# Altium schematic sheet MCU.SchDoc
size A3; DocumentNumber: 6; SheetNumber: 6; SheetTotal: 11
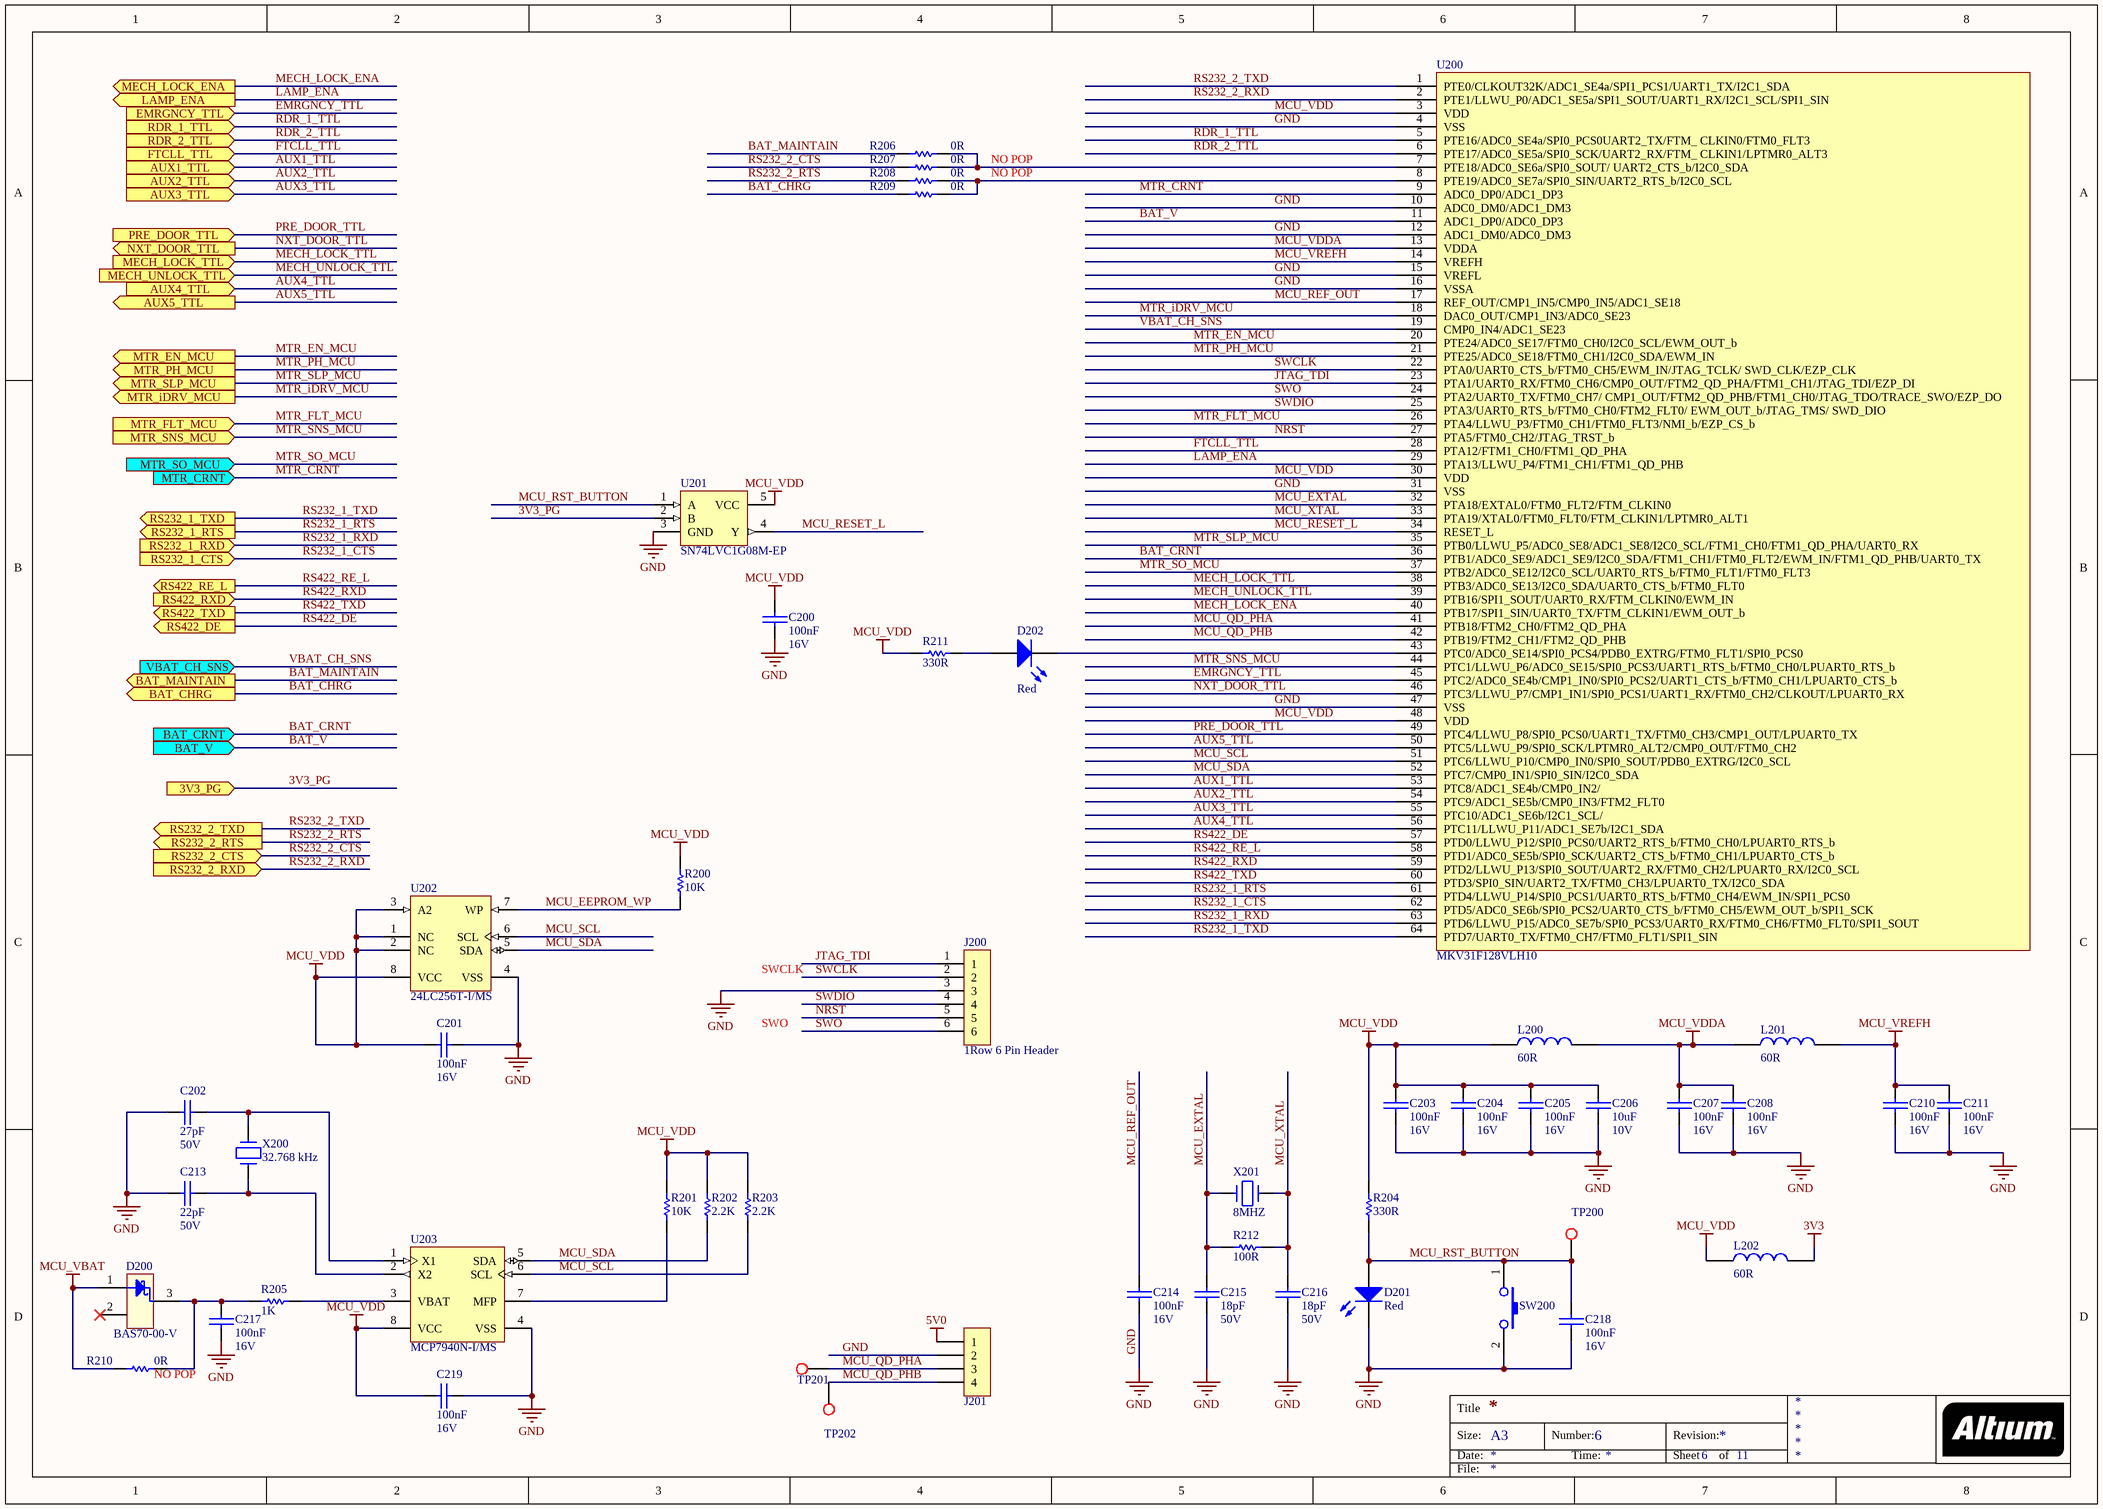
[diagram p0: MCU.SchDoc]

## Parts
C200  Operating Voltage: 16V  [CAPC1005X06N]  (hidden comment: 100nF)
C201  Operating Voltage: 16V  [CAPC1005X06N]  (hidden comment: 100nF)
C202  Operating Voltage: 50V  [CAPC1005X06N]  (hidden comment: 27pF)
C203  Operating Voltage: 16V  [CAPC1005X06N]  (hidden comment: 100nF)
C204  Operating Voltage: 16V  [CAPC1005X06N]  (hidden comment: 100nF)
C205  Operating Voltage: 16V  [CAPC1005X06N]  (hidden comment: 100nF)
C206  Operating Voltage: 10V  [CAPC2012X09N]  (hidden comment: 10uF)
C207  Operating Voltage: 16V  [CAPC1005X06N]  (hidden comment: 100nF)
C208  Operating Voltage: 16V  [CAPC1005X06N]  (hidden comment: 100nF)
C210  Operating Voltage: 16V  [CAPC1005X06N]  (hidden comment: 100nF)
C211  Operating Voltage: 16V  [CAPC1005X06N]  (hidden comment: 100nF)
C213  Operating Voltage: 50V  [CAPC1005X06N]  (hidden comment: 22pF)
C214  Operating Voltage: 16V  [CAPC1005X06N]  (hidden comment: 100nF)
C215  Operating Voltage: 50V  [CAPC1005X06N]  (hidden comment: 18pF)
C216  Operating Voltage: 50V  [CAPC1005X06N]  (hidden comment: 18pF)
C217  Operating Voltage: 16V  [CAPC1005X06N]  (hidden comment: 100nF)
C218  Operating Voltage: 16V  [CAPC1005X06N]  (hidden comment: 100nF)
C219  Operating Voltage: 16V  [CAPC1005X06N]  (hidden comment: 100nF)
D200  BAS70-00-V  [SOT90P247X115-3N]
D201  Red  [LEDSC16X08X08-2N]
D202  Red  [LEDSC16X08X08-2N]
J200  1Row 6 Pin Header  [AJ23-1006-T8P0-VFC0]
J201  (no value)  [AJ61-1004-TAPR-RNS0]
L200  60R  [INDC2012X10N]
L201  60R  [INDC2012X10N]
L202  60R  [INDC2012X10N]
R200  10K  [RESC1005X04N]
R201  10K  [RESC1005X04N]
R202  2.2K  [RESC1005X04N]
R203  2.2K  [RESC1005X04N]
R204  330R  [RESC1005X04N]
R205  1K  [RESC1005X04N]
R206  0R  [RESC1005X04N]
R207  Assembly: NO POP  [RESC1005X04N]  (hidden comment: 0R)
R208  Assembly: NO POP  [RESC1005X04N]  (hidden comment: 0R)
R209  0R  [RESC1005X04N]
R210  Assembly: NO POP  [RESC2012X07N]  (hidden comment: 0R)
R211  330R  [RESC1005X04N]
R212  100R  [RESC1005X04N]
SW200  Push Button  [AE22-010S-0000-0000]  (value not drawn)
TP200  AEMT-C00S-1000-0000  [TP100]  (value not drawn)
TP201  AEMT-C00S-1000-0000  [TP100]  (value not drawn)
TP202  AEMT-C00S-1000-0000  [TP100]  (value not drawn)
U200  MKV31F128VLH10  [TSQFP50P1200X1200X160-64N]
U201  SN74LVC1G08M-EP  [SOT65P210X110-5N]
U202  24LC256T-I/MS  [MSOP-MS8_N]
U203  MCP7940N-I/MS  [MSOP-MS8_N]
X200  32.768 kHz  [XTAL32X15X09]
X201  8MHZ  [XTAL50X32X13]

## Ports
3V3_PG (in), AUX1_TTL (in), AUX2_TTL (in), AUX3_TTL (in), AUX4_TTL (in), AUX5_TTL (out), BAT_CHRG (out), BAT_CRNT (in), BAT_MAINTAIN (out), BAT_V (in), EMRGNCY_TTL (in), FTCLL_TTL (in), LAMP_ENA (out), MECH_LOCK_ENA (out), MECH_LOCK_TTL (in), MECH_UNLOCK_TTL (in), MTR_CRNT (in), MTR_EN_MCU (out), MTR_FLT_MCU (in), MTR_iDRV_MCU (out), MTR_PH_MCU (out), MTR_SLP_MCU (out), MTR_SNS_MCU (in), MTR_SO_MCU (in), NXT_DOOR_TTL (out), PRE_DOOR_TTL (in), RDR_1_TTL (in), RDR_2_TTL (in), RS232_1_CTS (in), RS232_1_RTS (out), RS232_1_RXD (in), RS232_1_TXD (out), RS232_2_CTS (in), RS232_2_RTS (out), RS232_2_RXD (in), RS232_2_TXD (out), RS422_DE (out), RS422_RE_L (out), RS422_RXD (in), RS422_TXD (out), VBAT_CH_SNS (in)

## Nets
3V3: L202.2
5V0: J201.1
GND: C200.2 C201.1 C202.1 C203.1 C204.1 C205.1 C206.1 C207.1 C208.1 C210.1 C211.1 C213.1 C214.1 C215.2 C216.2 C217.2 C218.1 C219.1 D201.1(K) J200.3 J201.2 SW200.2 U200.4(VSS) U200.10(ADC0_DM0/ADC1_DM3) U200.12(ADC1_DM0/ADC0_DM3) U200.15(VREFL) U200.16(VSSA) U200.31(VSS) U200.47(VSS) U201.3(GND) U202.4(VSS) U203.4(VSS)
MCU_VBAT: D200.1 R210.1
MCU_VDD: C200.1 C201.2 C203.2 C204.2 C205.2 C206.2 C219.2 L200.1 L202.1 R200.2 R201.2 R202.2 R203.2 R204.2 R211.2 U200.3(VDD) U200.30(VDD) U200.48(VDD) U201.5(VCC) U202.1(NC) U202.2(NC) U202.3(A2) U202.8(VCC) U203.8(VCC)
MCU_VDDA: C207.2 C208.2 L200.2 L201.1 U200.13(VDDA)
MCU_VREFH: C210.2 C211.2 L201.2 U200.14(VREFH)
3V3_PG: U201.2(B) ; port 3V3_PG
AUX1_TTL: U200.53(PTC8/ADC1_SE4b/CMP0_IN2/) ; port AUX1_TTL
AUX2_TTL: U200.54(PTC9/ADC1_SE5b/CMP0_IN3/FTM2_FLT0) ; port AUX2_TTL
AUX3_TTL: U200.55(PTC10/ADC1_SE6b/I2C1_SCL/) ; port AUX3_TTL
AUX4_TTL: U200.56(PTC11/LLWU_P11/ADC1_SE7b/I2C1_SDA) ; port AUX4_TTL
AUX5_TTL: U200.50(PTC5/LLWU_P9/SPI0_SCK/LPTMR0_ALT2/CMP0_OUT/FTM0_CH2) ; port AUX5_TTL
BAT_CHRG: R209.1 ; port BAT_CHRG
BAT_CRNT: U200.36(PTB1/ADC0_SE9/ADC1_SE9/I2C0_SDA/FTM1_CH1/FTM0_FLT2/EWM_IN/FTM1_QD_PHB/UART0_TX) ; port BAT_CRNT
BAT_MAINTAIN: R206.1 ; port BAT_MAINTAIN
BAT_V: U200.11(ADC1_DP0/ADC0_DP3) ; port BAT_V
EMRGNCY_TTL: U200.45(PTC2/ADC0_SE4b/CMP1_IN0/SPI0_PCS2/UART1_CTS_b/FTM0_CH1/LPUART0_CTS_b) ; port EMRGNCY_TTL
FTCLL_TTL: U200.28(PTA12/FTM1_CH0/FTM1_QD_PHA) ; port FTCLL_TTL
JTAG_TDI: J200.1 U200.23(PTA1/UART0_RX/FTM0_CH6/CMP0_OUT/FTM2_QD_PHA/FTM1_CH1/JTAG_TDI/EZP_DI)
LAMP_ENA: U200.29(PTA13/LLWU_P4/FTM1_CH1/FTM1_QD_PHB) ; port LAMP_ENA
MCU_EEPROM_WP: R200.1 U202.7(WP)
MCU_EXTAL: C215.1 R212.1 U200.32(PTA18/EXTAL0/FTM0_FLT2/FTM_CLKIN0) X201.1
MCU_QD_PHA: J201.3 TP201.1 U200.41(PTB18/FTM2_CH0/FTM2_QD_PHA)
MCU_QD_PHB: J201.4 TP202.1 U200.42(PTB19/FTM2_CH1/FTM2_QD_PHB)
MCU_REF_OUT: C214.2 U200.17(REF_OUT/CMP1_IN5/CMP0_IN5/ADC1_SE18)
MCU_RESET_L: U200.34(RESET_L) U201.4(Y)
MCU_RST_BUTTON: C218.2 D201.2(A) R204.1 SW200.1 TP200.1 U201.1(A)
MCU_SCL: R203.1 U200.51(PTC6/LLWU_P10/CMP0_IN0/SPI0_SOUT/PDB0_EXTRG/I2C0_SCL) U202.6(SCL) U203.6(SCL)
MCU_SDA: R202.1 U200.52(PTC7/CMP0_IN1/SPI0_SIN/I2C0_SDA) U202.5(SDA) U203.5(SDA)
MCU_XTAL: C216.1 R212.2 U200.33(PTA19/XTAL0/FTM0_FLT0/FTM_CLKIN1/LPTMR0_ALT1) X201.2
MECH_LOCK_ENA: U200.40(PTB17/SPI1_SIN/UART0_TX/FTM_CLKIN1/EWM_OUT_b) ; port MECH_LOCK_ENA
MECH_LOCK_TTL: U200.38(PTB3/ADC0_SE13/I2C0_SDA/UART0_CTS_b/FTM0_FLT0) ; port MECH_LOCK_TTL
MECH_UNLOCK_TTL: U200.39(PTB16/SPI1_SOUT/UART0_RX/FTM_CLKIN0/EWM_IN) ; port MECH_UNLOCK_TTL
MTR_CRNT: U200.9(ADC0_DP0/ADC1_DP3) ; port MTR_CRNT
MTR_EN_MCU: U200.20(PTE24/ADC0_SE17/FTM0_CH0/I2C0_SCL/EWM_OUT_b) ; port MTR_EN_MCU
MTR_FLT_MCU: U200.26(PTA4/LLWU_P3/FTM0_CH1/FTM0_FLT3/NMI_b/EZP_CS_b) ; port MTR_FLT_MCU
MTR_iDRV_MCU: U200.18(DAC0_OUT/CMP1_IN3/ADC0_SE23) ; port MTR_iDRV_MCU
MTR_PH_MCU: U200.21(PTE25/ADC0_SE18/FTM0_CH1/I2C0_SDA/EWM_IN) ; port MTR_PH_MCU
MTR_SLP_MCU: U200.35(PTB0/LLWU_P5/ADC0_SE8/ADC1_SE8/I2C0_SCL/FTM1_CH0/FTM1_QD_PHA/UART0_RX) ; port MTR_SLP_MCU
MTR_SNS_MCU: U200.44(PTC1/LLWU_P6/ADC0_SE15/SPI0_PCS3/UART1_RTS_b/FTM0_CH0/LPUART0_RTS_b) ; port MTR_SNS_MCU
MTR_SO_MCU: U200.37(PTB2/ADC0_SE12/I2C0_SCL/UART0_RTS_b/FTM0_FLT1/FTM0_FLT3) ; port MTR_SO_MCU
NRST: J200.5 U200.27(PTA5/FTM0_CH2/JTAG_TRST_b)
NXT_DOOR_TTL: U200.46(PTC3/LLWU_P7/CMP1_IN1/SPI0_PCS1/UART1_RX/FTM0_CH2/CLKOUT/LPUART0_RX) ; port NXT_DOOR_TTL
PRE_DOOR_TTL: U200.49(PTC4/LLWU_P8/SPI0_PCS0/UART1_TX/FTM0_CH3/CMP1_OUT/LPUART0_TX) ; port PRE_DOOR_TTL
RDR_1_TTL: U200.5(PTE16/ADC0_SE4a/SPI0_PCS0UART2_TX/FTM__CLKIN0/FTM0_FLT3) ; port RDR_1_TTL
RDR_2_TTL: U200.6(PTE17/ADC0_SE5a/SPI0_SCK/UART2_RX/FTM__CLKIN1/LPTMR0_ALT3) ; port RDR_2_TTL
RS232_1_CTS: U200.62(PTD5/ADC0_SE6b/SPI0_PCS2/UART0_CTS_b/FTM0_CH5/EWM_OUT_b/SPI1_SCK) ; port RS232_1_CTS
RS232_1_RTS: U200.61(PTD4/LLWU_P14/SPI0_PCS1/UART0_RTS_b/FTM0_CH4/EWM_IN/SPI1_PCS0) ; port RS232_1_RTS
RS232_1_RXD: U200.63(PTD6/LLWU_P15/ADC0_SE7b/SPI0_PCS3/UART0_RX/FTM0_CH6/FTM0_FLT0/SPI1_SOUT) ; port RS232_1_RXD
RS232_1_TXD: U200.64(PTD7/UART0_TX/FTM0_CH7/FTM0_FLT1/SPI1_SIN) ; port RS232_1_TXD
RS232_2_CTS: R207.1 ; port RS232_2_CTS
RS232_2_RTS: R208.1 ; port RS232_2_RTS
RS232_2_RXD: U200.2(PTE1/LLWU_P0/ADC1_SE5a/SPI1_SOUT/UART1_RX/I2C1_SCL/SPI1_SIN) ; port RS232_2_RXD
RS232_2_TXD: U200.1(PTE0/CLKOUT32K/ADC1_SE4a/SPI1_PCS1/UART1_TX/I2C1_SDA) ; port RS232_2_TXD
RS422_DE: U200.57(PTD0/LLWU_P12/SPI0_PCS0/UART2_RTS_b/FTM0_CH0/LPUART0_RTS_b) ; port RS422_DE
RS422_RE_L: U200.58(PTD1/ADC0_SE5b/SPI0_SCK/UART2_CTS_b/FTM0_CH1/LPUART0_CTS_b) ; port RS422_RE_L
RS422_RXD: U200.59(PTD2/LLWU_P13/SPI0_SOUT/UART2_RX/FTM0_CH2/LPUART0_RX/I2C0_SCL) ; port RS422_RXD
RS422_TXD: U200.60(PTD3/SPI0_SIN/UART2_TX/FTM0_CH3/LPUART0_TX/I2C0_SDA) ; port RS422_TXD
SWCLK: J200.2 U200.22(PTA0/UART0_CTS_b/FTM0_CH5/EWM_IN/JTAG_TCLK/_SWD_CLK/EZP_CLK)
SWDIO: J200.4 U200.25(PTA3/UART0_RTS_b/FTM0_CH0/FTM2_FLT0/_EWM_OUT_b/JTAG_TMS/_SWD_DIO)
SWO: J200.6 U200.24(PTA2/UART0_TX/FTM0_CH7/_CMP1_OUT/FTM2_QD_PHB/FTM1_CH0/JTAG_TDO/TRACE_SWO/EZP_DO)
VBAT_CH_SNS: U200.19(CMP0_IN4/ADC1_SE23) ; port VBAT_CH_SNS
NetC202_2: C202.2 U203.1(X1) X200.2
NetC213_2: C213.2 U203.2(X2) X200.1
NetC217_1: C217.1 D200.3 R205.1 R210.2
NetD202_1: D202.1(K) U200.43(PTC0/ADC0_SE14/SPI0_PCS4/PDB0_EXTRG/FTM0_FLT1/SPI0_PCS0)
NetD202_2: D202.2(A) R211.1
NetR201_1: R201.1 U203.7(MFP)
NetR205_2: R205.2 U203.3(VBAT)
NetR206_2: R206.2 R207.2 U200.7(PTE18/ADC0_SE6a/SPI0_SOUT/_UART2_CTS_b/I2C0_SDA)
NetR208_2: R208.2 R209.2 U200.8(PTE19/ADC0_SE7a/SPI0_SIN/UART2_RTS_b/I2C0_SCL)

Not connected (* = marked no-connect by the designer): D200 2(NC)*

## Notes on the sheet
- SWCLK
- SWO
- Title
- Size:
- Date:
- A3
- Number:
- Time:
- Revision:
- Sheet
- of
- File:

## Library data of the parts
C200 C201 C203-C205 C207 C208 C210 C211 C214 C217-C219 = ACC7-2100-S241-0000: CAP, CER, X7R, 100nF, %10, 16V, 0402; Manufacturer: Murata; Manufacturer Part Number: GRM155R71C104KA88D; CR: 000049; Requested by: MU; Lead Finish: Pb Free; Material: Ceramic, X7R; Definition Date: 14.08.2012; Revision Date: *; Price: *; Supplier: *; Supplier Part Number: *; DS: 000049; Operating Temp: -55 to 125 C; Storage Temp: -55 to 125 C; Status: Active; Package Reference: EIA 0402, Metric 1005; Component Type: Capacitor; Footprint Type: SMD; Published by: MU; ESR: *; FR: *; Value: 100nF
C202 = ACC0-Y270-S272-0000: CAP, CER, C0G, 27pF, %5, 50V, 0402; Manufacturer: Murata; Manufacturer Part Number: GRM1555C1H270JA01D; CR: 000049; Requested by: MU; Lead Finish: Pb Free; Material: Ceramic, C0G; Definition Date: 14.08.2012; Revision Date: *; Price: *; Supplier: *; Supplier Part Number: *; DS: 000049; Operating Temp: -55 to 125 C; Storage Temp: -55 to 125 C; Status: Active; Package Reference: EIA 0402, Metric 1005; Component Type: Capacitor; Footprint Type: SMD; Published by: MU; ESR: *; FR: *; Value: 27pF
C206 = ACC7-4100-S431-0000: CAP, CER, X7R, 10uF, %10, 10V, 0805; Manufacturer: Murata; Manufacturer Part Number: GRM21BR71A106KE51L; CR: 000049; Requested by: MAY; Lead Finish: Pb Free; Published by: MU; Material: Ceramic, X7R; Definition Date: 22.10.2012; Revision Date: *; Price: *; Supplier: *; Supplier Part Number: *; DS: 000049; Operating Temp: -55 to 125 C; Storage Temp: -55 to 125 C; Status: Active; Package Reference: EIA 0805, Metric 2012; Component Type: Capacitor; Footprint Type: SMD; ESR: *; FR: *; Value: 10uF
C213 = ACC0-Y220-S272-0000: CAP, CER, C0G, 22pF, %5, 50V, 0402; Manufacturer: Murata; Manufacturer Part Number: GRM1555C1H220JA01D; CR: 000049; Requested by: MU; Lead Finish: Pb Free; Material: Ceramic, C0G; Definition Date: 14.08.2012; Revision Date: *; Price: *; Supplier: *; Supplier Part Number: *; DS: 000049; Operating Temp: -55 to 125 C; Storage Temp: -55 to 125 C; Status: Active; Package Reference: EIA 0402, Metric 1005; Component Type: Capacitor; Footprint Type: SMD; Published by: MU; ESR: *; FR: *; Value: 22pF
C215 C216 = ACC0-Y180-S272-0000: CAP, CER, C0G, 18pF, %5, 50V, 0402; Manufacturer: Murata; Manufacturer Part Number: GRM1555C1H180JA01D; CR: 000049; Requested by: MU; Lead Finish: Pb Free; Material: Ceramic, C0G; Definition Date: 14.08.2012; Revision Date: *; Price: *; Supplier: *; Supplier Part Number: *; DS: 000049; Operating Temp: -55 to 125 C; Storage Temp: -55 to 125 C; Status: Active; Package Reference: EIA 0402, Metric 1005; Component Type: Capacitor; Footprint Type: SMD; Published by: MU; ESR: *; FR: *; Value: 18pF
D200 = AS15-820M-SI20-0002: Diode, Schottky, 0.41V @1mA, BAS70-00-V, SOT23; Manufacturer: VISHAY; CR: 000193/78; DS: 000193; Lead Finish: Pb Free; Published by: MU; Requested by: OO; Reverse Voltage: 70V; Price: *; Manufacturer Part Number: BAS70-00-V; Definition Date: 07.02.2013; Footprint Type: SMD; JEDEC Code: *; Operating Temp: -65 to 125 C; Package Reference: SOT23; Revision Date: 16.02.2013; Status: Active; Storage Temp: -65 to 150 C; Supplier: *; Supplier Part Number: *; Component Type: DIODE; Forward Voltage: 0.41V @1mA; Value: BAS70-00-V
D201 D202 = AS42-730L-SC50-0000: LED, Red, 627 nm, 15 mcd, 120 degree, 2V, SMD, 0603; Manufacturer Part Number: APT1608EC; Manufacturer: Kingbright; CR: 000172; Lead Finish: Pb Free; Published by: MU; Requested by: OO; Price: *; DS: 000172; Definition Date: 17.12.2012; Footprint Type: SMD; JEDEC Code: *; Operating Temp: -40°C To +85°C; Package Reference: EIA 0603, Metric 1608; Revision Date: *; Status: Active; Storage Temp: -40°C To +85°C; Supplier: *; Supplier Part Number: *; Component Type: LED; Forward Voltage: 2V; Value: Red
J200 = AJ23-1006-T8P0-VFC0: CON, W2B, 6 Pins, 1-Row, 2.54mm, TH, P, VER; Manufacturer: FCI; Manufacturer Part Number: 68001-206HLF; CR: 000184; Requested by: NK; Lead Finish: Pb Free; Published by: MU; Definition Date: 30.01.2013; Revision Date: *; Price: *; Supplier: *; Supplier Part Number: *; DS: 000184; Operating Temp: *; Storage Temp: *; Status: Active; Package Reference: *; Component Type: Connector; Footprint Type: TH; JEDEC Code: *; Material: *; Max. Operating Voltage: *; Rated Current: *; Value: 1Row 6 Pin Header
J201 = AJ61-1004-TAPR-RNS0: CON, Terminal, Klemens, 4 Pins, 1-Row, 5.08mm, TH, P, R; Manufacturer: ON-SHORE; Manufacturer Part Number: OSTOQ045451; Requested by: NK; Lead Finish: Pb Free; Max. Operating Voltage: 250VAC; Rated Current: 15A; CR: -; Definition Date: 11.08.2015; Revision Date: *; Price: *; Supplier: *; Supplier Part Number: *; DS: -; Operating Temp: -30, +105; Storage Temp: -30, +105; Status: Active; Package Reference: *; Component Type: Connector; Footprint Type: TH; Published by: NK; JEDEC Code: *; Material: *
L200-L202 = AL5F-1600-S236-3350: Inductor, Ferrite Bead, 3.5A, 60 Ohm, SMD; Manufacturer: Murata; Manufacturer Part Number: BLM21PG600SN1D; CR: 000057; DCR(max): 20mR; Lead Finish: Pb Free; Published By: MU; Impedance: 60ohm @100Mhz; Value: 10uH; Price: *; DS: 000057; Component Type: Ferrite Bead; Definition Date: 24.08.2012; Footprint Type: SMD; Height: 1.05mm; JEDEC Code: *; Operating Temp: -55 to 125°C; Package Reference: *; Rated Current: 3.5A; Requested By: MU; Revision Date: *; Status: Acitve; Storage Temp: -55 to 125°C; Supplier: *; Supplier Part Number: *
R200 R201 = AR19-4100-S2B2-0000: RES, E24, Thick Film, SMD, 10K, 1%, 0.1W, 0402; Manufacturer: Panasonic; Manufacturer Part Number: ERJ-2RKF1002X; CR: DS00073; Requested by: MU; Lead Finish: Pb Free; Max. Operating Voltage: 50V; Definition Date: 16.08.2012; Revision Date: *; Price: *; Supplier: *; Supplier Part Number: *; DS: DS00073; Operating Temp: -55 to 155 C; Storage Temp: -55 to 155 C; Status: Active; Package Reference: EIA 0402, Metric 1005; Component Type: Resistor; Footprint Type: SMD; Published by: MU; JEDEC Code: *; Material: Thick Film; ESR: *; FR: *; Power Rating: 0.1W; Value: 10K
R202 R203 = AR19-3220-S2B2-0000: RES, E24, Thick Film, SMD, 2.2K, 1%, 0.1W, 0402; Manufacturer: Panasonic; Manufacturer Part Number: ERJ-2RKF2201X; CR: DS00073; Requested by: MU; Lead Finish: Pb Free; Max. Operating Voltage: 50V; Definition Date: 16.08.2012; Revision Date: *; Price: *; Supplier: *; Supplier Part Number: *; DS: DS00073; Operating Temp: -55 to 155 C; Storage Temp: -55 to 155 C; Status: Active; Package Reference: EIA 0402, Metric 1005; Component Type: Resistor; Footprint Type: SMD; Published by: MU; JEDEC Code: *; Material: Thick Film; ESR: *; FR: *; Power Rating: 0.1W; Value: 2.2K
R204 R211 = AR19-2330-S2B2-0000: RES, E24, Thick Film, SMD, 330R, 1%, 0.1W, 0402; Manufacturer: Panasonic; Manufacturer Part Number: ERJ-2RKF3300X; CR: DS00073; Requested by: MU; Lead Finish: Pb Free; Max. Operating Voltage: 50V; Definition Date: 16.08.2012; Revision Date: *; Price: *; Supplier: *; Supplier Part Number: *; DS: DS00073; Operating Temp: -55 to 155 C; Storage Temp: -55 to 155 C; Status: Active; Package Reference: EIA 0402, Metric 1005; Component Type: Resistor; Footprint Type: SMD; Published by: MU; JEDEC Code: *; Material: Thick Film; ESR: *; FR: *; Power Rating: 0.1W; Value: 330R
R205 = AR19-3100-S2B2-0000: RES, E24, Thick Film, SMD, 1K, 1%, 0.1W, 0402; Manufacturer: Panasonic; Manufacturer Part Number: ERJ-2RKF1001X; CR: DS00073; Requested by: MU; Lead Finish: Pb Free; Max. Operating Voltage: 50V; Definition Date: 16.08.2012; Revision Date: *; Price: *; Supplier: *; Supplier Part Number: *; DS: DS00073; Operating Temp: -55 to 155 C; Storage Temp: -55 to 155 C; Status: Active; Package Reference: EIA 0402, Metric 1005; Component Type: Resistor; Footprint Type: SMD; Published by: MU; JEDEC Code: *; Material: Thick Film; ESR: *; FR: *; Power Rating: 0.1W; Value: 1K
R206-R209 = AR19-0000-S201-0000: RES, Thick Film, SMD, 0R, Jumper, 0.1W, 0402; Manufacturer: Panasonic; Manufacturer Part Number: ERJ-2GE0R00X; CR: 000062; Requested by: MAY; Lead Finish: Pb Free; Published by: MU; Max. Operating Voltage: 50V; Definition Date: 09.07.2012; Revision Date: *; Price: *; Supplier: *; Supplier Part Number: *; DS: 000062; Operating Temp: -55 to 155 C; Storage Temp: -55 to 155 C; Status: Active; Package Reference: EIA 0402, Metric 1005; Component Type: Resistor; Footprint Type: SMD; JEDEC Code: *; Material: Thick Film; ESR: *; FR: *; Power Rating: 0.1W; Value: 0R
R210 = AR19-0000-S407-0000: RES, Thick Film, SMD, 0R, Jumper, 0.125W, 0805; Manufacturer: Panasonic; Manufacturer Part Number: ERJ-6GEY0R00V; CR: 000062; Requested by: MAY; Lead Finish: Pb Free; Published by: MU; Max. Operating Voltage: 150V; Definition Date: 09.11.2012; Revision Date: *; Price: *; Supplier: *; Supplier Part Number: *; DS: 000062; Operating Temp: -55 to 155 C; Storage Temp: -55 to 155 C; Status: Active; Package Reference: EIA 0805, Metric 2012; Component Type: Resistor; Footprint Type: SMD; JEDEC Code: *; Material: Thick Film; ESR: *; FR: *; Power Rating: 0.125W; Value: 0R
R212 = AR19-2100-S2B2-0000: RES, E24, Thick Film, SMD, 100R, 1%, 0.1W, 0402; Manufacturer: Panasonic; Manufacturer Part Number: ERJ-2RKF1000X; CR: DS00073; Requested by: MU; Lead Finish: Pb Free; Max. Operating Voltage: 50V; Definition Date: 16.08.2012; Revision Date: *; Price: *; Supplier: *; Supplier Part Number: *; DS: DS00073; Operating Temp: -55 to 155 C; Storage Temp: -55 to 155 C; Status: Active; Package Reference: EIA 0402, Metric 1005; Component Type: Resistor; Footprint Type: SMD; Published by: MU; JEDEC Code: *; Material: Thick Film; ESR: *; FR: *; Power Rating: 0.1W; Value: 100R
SW200 = AE22-010S-0000-0000: Switch, Push, SMD 6.6x6.0mm, Trip Force 350g; Manufacturer: Panasonic; Manufacturer Part Number: EVQ-Q2203W; CR: 00183/63; DS: 00183; Published By: MU; Requested By: NK; Current Rating: 20mA; Max. Operating Voltage: 15V; Definition Date: 25.01.2013; Height: 3.1mm; Operating Temp: -40 °C to +85 °C; Footprint Type: SMD; Revision: *; Revision Date: *; Lead Finish: *; Status: Active; Storage Temp: -40 °C to +85 °C; Component Type: Switch; JEDEC Code: *; Package Reference: SMD 6.6x6.0mm; Price: *; Supplier: *; Supplier Part Number: *; Value: Push Button
TP200-TP202 = AEMT-C00S-1000-0000: Test Point, Circular, 1mm; Text: TEST_POINT
U200 = AT35-0000-SF80-1840: IC, Embedded, Microcontroller, MKV31F128VLH10, LQFP64; Manufacturer: Freescale; Published by: NK; Component Type: IC; CR: -; Definition Date: 25.07.2015; DS: -; Footprint Type: SMD; JEDEC Code: -; Lead Finish: -; Manufacturer Part Number: MKV31F128VLH10; Operating Temp: -40, +105; Package Reference: LQFP64; Requested by: NK; Status: Active; FR: -
U201 = AT66-0000-SI20-0460: IC, Logic, AND Gate, SN74LVC1G08M-EP, SOT353; Manufacturer: Texas Instruments; Manufacturer Part Number: SN74LVC1G08MDCKREP; CR: 000144; JEDEC Code: MO-203-AA; Lead Finish: Pb Free; Published by: MU; Requested by: MAY; Component Type: IC; Definition Date: 09.11.2012; DS: 000144; Footprint Type: SMD; Operating Temp: -55°C to 125°C; Package Reference: SOT353; Price: *; Revision Date: *; Status: Active; Storage Temp: -65°C to 125°C; Supplier: *; Supplier Part Number: *; FR: *; Value: SN74LVC1G08M-EP
U202 = 24LC256T-I/MS: 256Kbit, 400kHz, 2.5V, I2C Serial EEPROM, 8-Pin MSOP, Industrial Temperature, Tape and Reel; Manufacturer: Microchip; DatasheetVersion: revP, Oct-2007; PackageVersion: revBB, Aug-2009; PackageReference: MSOP-MS8; PackageDescription: 8-Lead Plastic Micro Small Outline Package (MS) [MSOP]; Supplier 1: Digi-Key; Supplier Part Number 1: 24LC256T-I/MSTR-ND; Supplier 2: Digi-Key; Supplier Part Number 2: 24LC256T-I/MSCT-ND; Supplier 3: Digi-Key; Supplier Part Number 3: 24LC256T-I/MSDKR-ND; Supplier 4: Farnell; Supplier Part Number 4: 1816069; Supplier 5: Newark; Supplier Part Number 5: 92C7178; Supplier 6: Mouser; Supplier Part Number 6: 579-24LC256T-I/MS; Mounting Technology: Surface Mount; PartNumber: 24LC256T-I/MS; ComponentLink1Description: Manufacturer URL; ComponentLink1URL: http://www.microchip.com/; ComponentLink2Description: Datasheet; ComponentLink2URL: http://ww1.microchip.com/downloads/en/DeviceDoc/21203P.pdf; ComponentLink3Description: Package Specification; ComponentLink3URL: http://www.microchip.com/stellent/groups/techpub_sg/documents/packagingspec/en012702.pdf
U203 = MCP7940N-I/MS: Low-Cost I2C Real-Time Clock/Calendar with SRAM and Battery Switchover, 8-Pin MSOP, Industrial Temperature; Manufacturer: Microchip; DatasheetVersion: revC, Dec-2011; PackageVersion: revBB, Aug-2009; PackageReference: MSOP-MS8; PackageDescription: 8-Lead Plastic Micro Small Outline Package (MS) [MSOP]; Supplier 1: Digi-Key; Supplier Part Number 1: MCP7940N-I/MS-ND; Supplier 2: Newark; Supplier Part Number 2: 26T2747; Supplier 3: Mouser; Supplier Part Number 3: 579-MCP7940N-I/MS; Mounting Technology: Surface Mount; PartNumber: MCP7940N-I/MS; ComponentLink1Description: Manufacturer URL; ComponentLink1URL: http://www.microchip.com/; ComponentLink2Description: Datasheet; ComponentLink2URL: http://ww1.microchip.com/downloads/en/DeviceDoc/25010C.pdf; ComponentLink3Description: Package Specification; ComponentLink3URL: http://www.microchip.com/stellent/groups/techpub_sg/documents/packagingspec/en012702.pdf
X200 = AX20-4327-S000-0000: Crystal, Fund, 32.768 kHz, 10ppm, 12.5pF, SMD; Manufacturer: Citizen; Manufacturer Part Number: CM315-32.768KEZF-UT; CR: 000140; Lead Finish: Pb Free; Published by: MU; Requested by: OO; Component Type: CRYSTAL; Definition Date: 07.11.2012; DS: 000140; Footprint Type: SMD; JEDEC Code: *; Operating Temp: -40°C to +85°C; Revision Date: 08.11.2012; Status: Active; Storage Temp: -55°C to +125°C; Supplier: *; Supplier Part Number: *; FR: *; Tolerance: 10ppm; Load Capacitance: 12.5pF; Frequency Stability: *; Value: 32.768 kHz
X201 = AX20-6800-S000-0000: Crystal, Fund, 8 MHZ, 20ppm, 18pF, SMD; Manufacturer: Abracon; Manufacturer Part Number: ABM3-8.000MHZ-D2Y-T; CR: 000080; Lead Finish: Pb Free; Published by: MU; Frequency Stability: 30ppm; Component Type: CRYSTAL; Definition Date: 28.08.2012; DS: 000080; Footprint Type: SMD; JEDEC Code: *; Operating Temp: -40 to 85 C; Requested by: MU; Revision Date: 04.09.2012; Status: Active; Storage Temp: -40 to 90 C; Supplier: *; Supplier Part Number: *; FR: *; Tolerance: 20ppm; Load Capacitance: 18pF; Value: 8MHZ